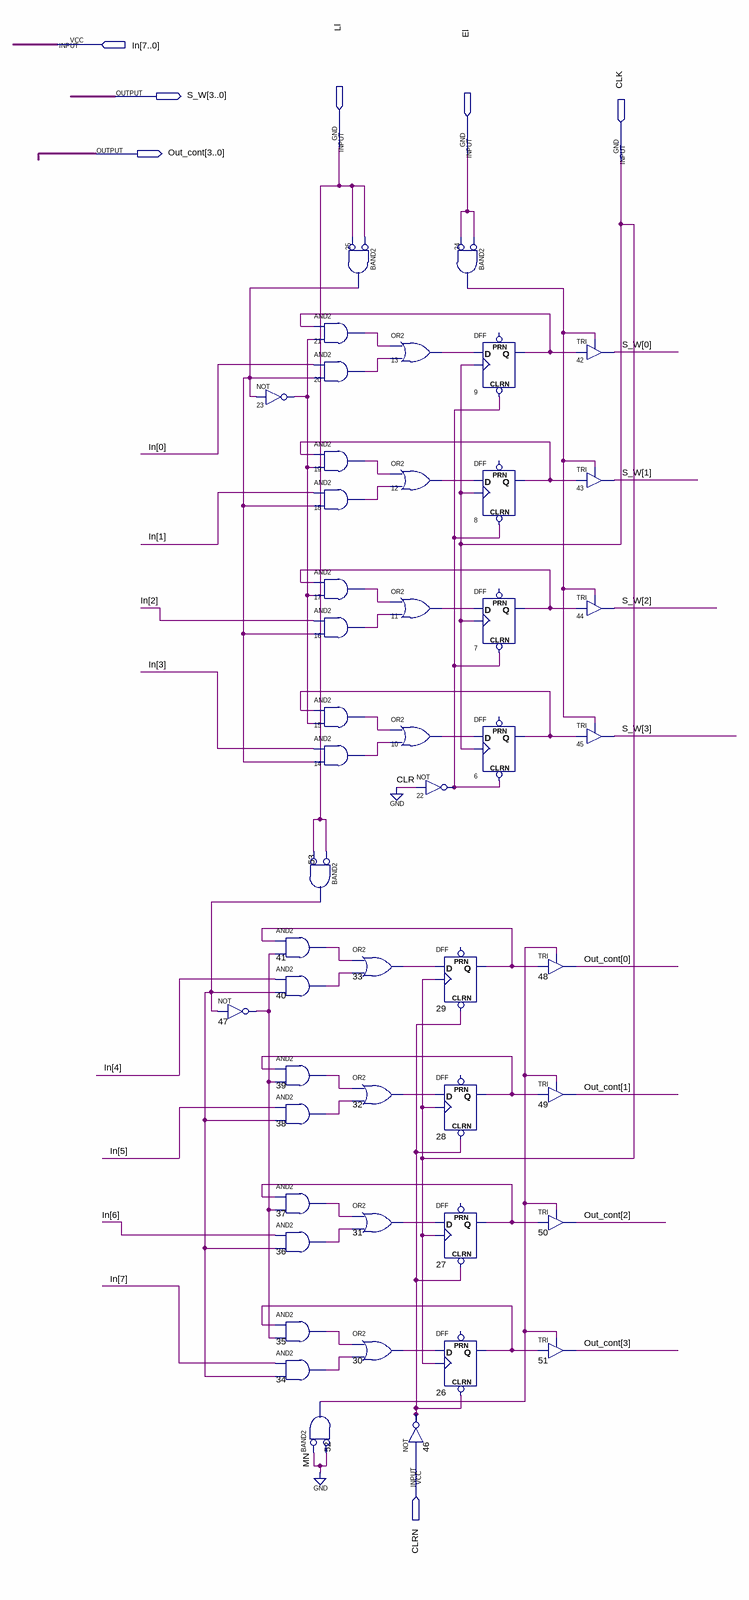
[diagram p0: schematic sheet]
// Quartus schematic Registrador_instrucoes.bdf as structural Verilog: 48 symbols, 7 pins
module Registrador_instrucoes (
  input  [7:0] In,
  input  Ll,
  input  El,
  input  CLK,
  input  CLRN,
  output [3:0] S_W,
  output [3:0] Out_cont
);

  wire n6_q, n7_q, n8_q, n9_q, n10_out, n11_out, n12_out, n13_out, n14_out, n15_out, n16_out, n17_out,
       n18_out, n19_out, n20_out, n21_out, n22_out, n23_out, n24_out, n25_out, n26_q, n27_q, n28_q, n29_q,
       n30_out, n31_out, n32_out, n33_out, n34_out, n35_out, n36_out, n37_out, n38_out, n39_out, n40_out,
       n41_out, n46_out, n47_out, n52_out, n53_out;

  not u_47 (n47_out, n53_out);
  not u_23 (n23_out, n25_out);
  and u_41 (n41_out, n29_q, n47_out);
  and u_40 (n40_out, In[4], n53_out);
  and u_39 (n39_out, n28_q, n47_out);
  and u_38 (n38_out, In[5], n53_out);
  and u_37 (n37_out, n27_q, n47_out);
  and u_36 (n36_out, In[6], n53_out);
  and u_35 (n35_out, n26_q, n47_out);
  and u_34 (n34_out, In[7], n53_out);
  and u_21 (n21_out, n9_q, n23_out);
  and u_20 (n20_out, In[0], n25_out);
  and u_19 (n19_out, n8_q, n23_out);
  and u_18 (n18_out, In[1], n25_out);
  and u_17 (n17_out, n7_q, n23_out);
  and u_16 (n16_out, In[2], n25_out);
  and u_15 (n15_out, n6_q, n23_out);
  and u_14 (n14_out, In[3], n25_out);
  and u_53 (n53_out, ~Ll, ~Ll);  // BAND2
  and u_52 (n52_out, ~1'b0, ~1'b0);  // BAND2
  and u_25 (n25_out, ~Ll, ~Ll);  // BAND2
  or u_13 (n13_out, n21_out, n20_out);
  or u_12 (n12_out, n19_out, n18_out);
  or u_11 (n11_out, n17_out, n16_out);
  or u_10 (n10_out, n15_out, n14_out);
  or u_33 (n33_out, n41_out, n40_out);
  or u_32 (n32_out, n39_out, n38_out);
  or u_31 (n31_out, n37_out, n36_out);
  or u_30 (n30_out, n35_out, n34_out);
  not u_22 (n22_out, 1'b0);
  DFF u_29 (.CLRN(n46_out), .CLK(CLK), .D(n33_out), .Q(n29_q));  // open: PRN
  DFF u_28 (.CLRN(n46_out), .CLK(CLK), .D(n32_out), .Q(n28_q));  // open: PRN
  DFF u_27 (.CLRN(n46_out), .CLK(CLK), .D(n31_out), .Q(n27_q));  // open: PRN
  DFF u_26 (.CLRN(n46_out), .CLK(CLK), .D(n30_out), .Q(n26_q));  // open: PRN
  not u_46 (n46_out, CLRN);
  and u_24 (n24_out, ~El, ~El);  // BAND2
  DFF u_9 (.CLRN(n22_out), .CLK(CLK), .D(n13_out), .Q(n9_q));  // open: PRN
  DFF u_8 (.CLRN(n22_out), .CLK(CLK), .D(n12_out), .Q(n8_q));  // open: PRN
  DFF u_7 (.CLRN(n22_out), .CLK(CLK), .D(n11_out), .Q(n7_q));  // open: PRN
  DFF u_6 (.CLRN(n22_out), .CLK(CLK), .D(n10_out), .Q(n6_q));  // open: PRN
  TRI u_48 (.IN(n29_q), .OE(n52_out), .OUT(Out_cont[0]));
  TRI u_49 (.IN(n28_q), .OE(n52_out), .OUT(Out_cont[1]));
  TRI u_50 (.IN(n27_q), .OE(n52_out), .OUT(Out_cont[2]));
  TRI u_51 (.IN(n26_q), .OE(n52_out), .OUT(Out_cont[3]));
  TRI u_42 (.IN(n9_q), .OE(n24_out), .OUT(S_W[0]));
  TRI u_43 (.IN(n8_q), .OE(n24_out), .OUT(S_W[1]));
  TRI u_44 (.IN(n7_q), .OE(n24_out), .OUT(S_W[2]));
  TRI u_45 (.IN(n6_q), .OE(n24_out), .OUT(S_W[3]));
endmodule
